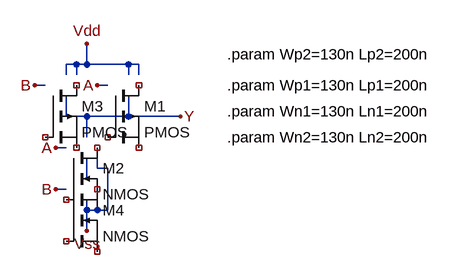
[diagram p0: schematic nand.asc]
nand.asc, the LTspice schematic file:
Version 4
SHEET 1 880 680
WIRE -176 -208 -192 -208
WIRE -160 -208 -160 -240
WIRE -160 -208 -176 -208
WIRE -96 -208 -160 -208
WIRE -80 -208 -96 -208
WIRE -192 -192 -192 -208
WIRE -176 -192 -176 -208
WIRE -96 -192 -96 -208
WIRE -80 -192 -80 -208
WIRE -224 -176 -240 -176
WIRE -128 -176 -144 -176
WIRE -192 -128 -192 -160
WIRE -160 -128 -192 -128
WIRE -96 -128 -96 -160
WIRE -96 -128 -160 -128
WIRE -16 -128 -96 -128
WIRE -160 -96 -160 -128
WIRE -192 -80 -208 -80
WIRE -144 -48 -144 -64
WIRE -128 -48 -144 -48
WIRE -160 -32 -160 -64
WIRE -192 -16 -208 -16
WIRE -160 16 -160 0
WIRE -144 16 -144 0
WIRE -144 16 -160 16
WIRE -128 16 -128 -48
WIRE -128 16 -144 16
WIRE -160 48 -160 16
FLAG -16 -128 Y
FLAG -144 -176 A
FLAG -160 48 Vss
FLAG -160 -240 Vdd
FLAG -208 -16 B
FLAG -208 -80 A
FLAG -240 -176 B
SYMBOL pmos -128 -176 R0
SYMATTR InstName M1
SYMATTR SpiceLine W={Wp1} L={Lp1}
SYMBOL nmos -192 -80 R0
SYMATTR InstName M2
SYMATTR SpiceLine W={Wn1} L={Ln1}
SYMBOL pmos -224 -176 R0
SYMATTR InstName M3
SYMATTR SpiceLine W={Wp2} L={Lp2}
SYMBOL nmos -192 -16 R0
SYMATTR InstName M4
SYMATTR SpiceLine W={Wn2} L={Ln2}
TEXT 56 -224 Left 2 !.param Wp2=130n Lp2=200n
TEXT 56 -176 Left 2 !.param Wp1=130n Lp1=200n
TEXT 56 -136 Left 2 !.param Wn1=130n Ln1=200n
TEXT 56 -96 Left 2 !.param Wn2=130n Ln2=200n

The netlist it stands for:
* nand.asc
* M1: PMOS W={Wp1} L={Lp1} (symbol pmos not certain, pin order unknown); nets seen at it: 
* M2: NMOS W={Wn1} L={Ln1} (symbol nmos not certain, pin order unknown); nets seen at it: Vss
* M3: PMOS W={Wp2} L={Lp2} (symbol pmos not certain, pin order unknown); nets seen at it: 
* M4: NMOS W={Wn2} L={Ln2} (symbol nmos not certain, pin order unknown); nets seen at it: 
.param Wp2=130n Lp2=200n
.param Wp1=130n Lp1=200n
.param Wn1=130n Ln1=200n
.param Wn2=130n Ln2=200n
.backanno
.end